# Altium schematic sheet ADC.SchDoc
size A4; SheetNumber: 5; SheetTotal: 14
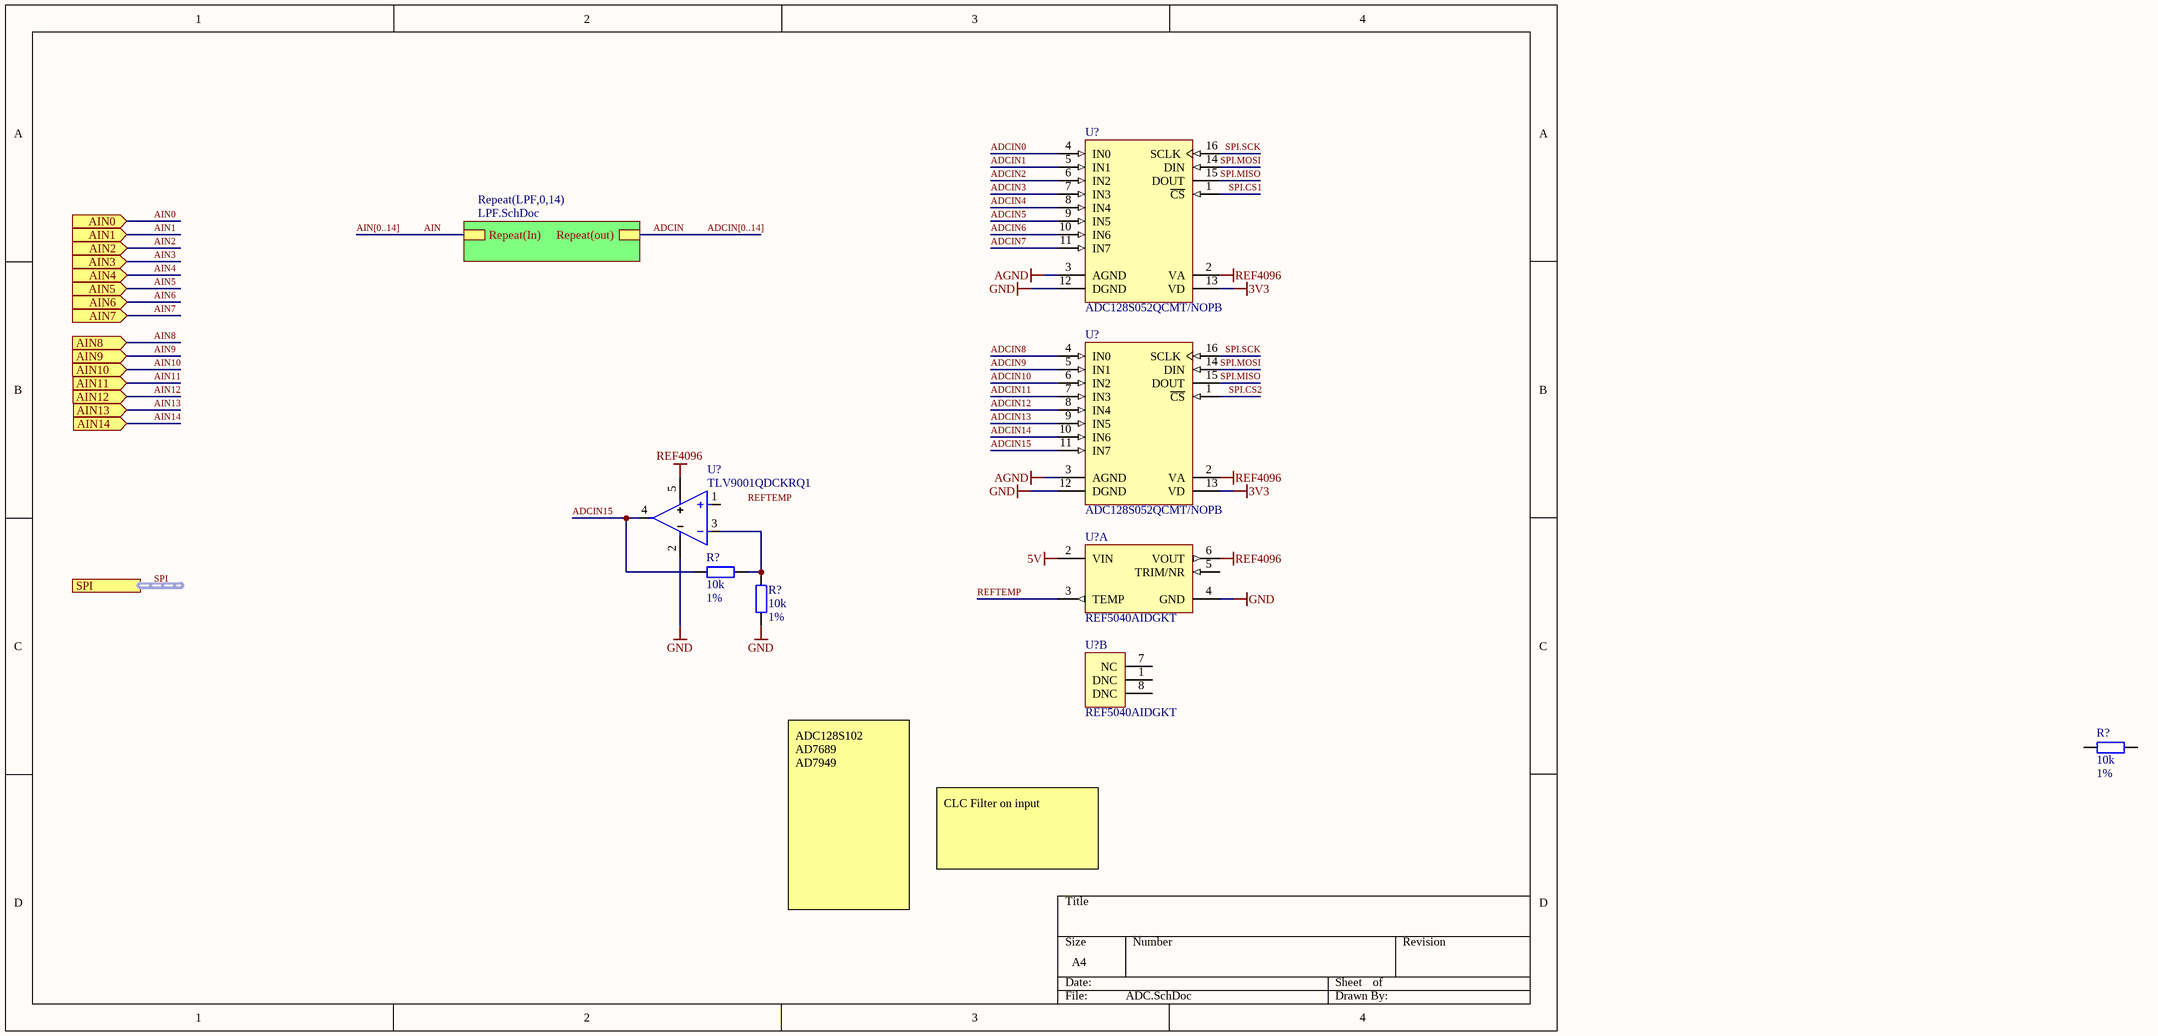
[diagram p0: ADC.SchDoc]

## Parts
(Parts that share a designator on the sheet are numbered #1, #2 ... from top to bottom, then left to right.)
R?#1  value 10k  Tolerance: 1%  [SMD_0603_RES]  (hidden comment: ERJ-3EKF1002V)
R?#2  value 10k  Tolerance: 1%  [SMD_0603_RES]  (hidden comment: ERJ-3EKF1002V)
R?#3  value 10k  Tolerance: 1%  [SMD_0603_RES]  (hidden comment: ERJ-3EKF1002V)
U?#1  ADC128S052QCMT/NOPB  [TI-PW16_L]
U?#2  ADC128S052QCMT/NOPB  [TI-PW16_L]
U?#3  TLV9001QDCKRQ1  [FP-DCK0005A-MFG]
U?#4  REF5040AIDGKT  [DGK0008A_N]  (part A of 2)
U?#5  REF5040AIDGKT  [DGK0008A_N]  (part B of 2)

## Sub-sheets
Repeat(LPF,0,14) = LPF.SchDoc: Repeat(In), Repeat(out)

## Ports
AIN0 (in), AIN1 (in), AIN2 (in), AIN3 (in), AIN4 (in), AIN5 (in), AIN6 (in), AIN7 (in), AIN8 (in), AIN9 (in), AIN10 (in), AIN11 (in), AIN12 (in), AIN13 (in), AIN14 (in), SPI (harness SPI)

## Nets
3V3: U?#1.13(VD) U?#2.13(VD)
5V: U?#4.2(VIN)
AGND: U?#1.3(AGND) U?#2.3(AGND)
GND: R?#2.1 U?#1.12(DGND) U?#2.12(DGND) U?#3.2(V-) U?#4.4(GND)
REF4096: U?#1.2(VA) U?#2.2(VA) U?#3.5(V+) U?#4.6(VOUT)
ADCIN: sheet Repeat(LPF,0,14)/Repeat(out)
ADCIN0: U?#1.4(IN0)
ADCIN1: U?#1.5(IN1)
ADCIN2: U?#1.6(IN2)
ADCIN3: U?#1.7(IN3)
ADCIN4: U?#1.8(IN4)
ADCIN5: U?#1.9(IN5)
ADCIN6: U?#1.10(IN6)
ADCIN7: U?#1.11(IN7)
ADCIN8: U?#2.4(IN0)
ADCIN9: U?#2.5(IN1)
ADCIN10: U?#2.6(IN2)
ADCIN11: U?#2.7(IN3)
ADCIN12: U?#2.8(IN4)
ADCIN13: U?#2.9(IN5)
ADCIN14: U?#2.10(IN6)
ADCIN15: R?#1.1 U?#2.11(IN7) U?#3.4(OUT)
AIN: sheet Repeat(LPF,0,14)/Repeat(In)
AIN0: port AIN0
AIN1: port AIN1
AIN2: port AIN2
AIN3: port AIN3
AIN4: port AIN4
AIN5: port AIN5
AIN6: port AIN6
AIN7: port AIN7
AIN8: port AIN8
AIN9: port AIN9
AIN10: port AIN10
AIN11: port AIN11
AIN12: port AIN12
AIN13: port AIN13
AIN14: port AIN14
REFTEMP: U?#4.3(TEMP)
SPI.CS1: U?#1.1(~{CS})
SPI.CS2: U?#2.1(~{CS})
SPI.MISO: U?#1.15(DOUT) U?#2.15(DOUT)
SPI.MOSI: U?#1.14(DIN) U?#2.14(DIN)
SPI.SCK: U?#1.16(SCLK) U?#2.16(SCLK)
NetR?#1_2: R?#1.2 R?#2.2 U?#3.3(-IN)

Not connected (* = marked no-connect by the designer): R?#3 1 2; U?#3 1(+IN); U?#4 5(TRIM/NR); U?#5 1(DNC) 7(NC) 8(DNC)

## Buses and harness runs
bus ADCIN[0..14]
bus AIN[0..14]
harness SPI = port SPI

## Notes on the sheet
- ADC128S102
  AD7689
  AD7949
- CLC Filter on input
- Labels drawn without touching a wire or pin: REFTEMP

## Library data of the parts
R?#1-R?#3 = CMP-009-07799-A10: RES SMD 10K OHM 1% 1/10W 0603 ±100ppm/°C; Voltage Rating: 75V; Power: 100mW; Pins: 2; RoHS Compliant: Yes; Temperature Coefficient: ±100ppm/°C; Operating Temperature (Min): -55°C; Mounting Technology: SMT; Case/Package: 0603; Operating Temperature (Max): 125°C
U?#1 U?#2 = CMP-0054-00500-3: 8-Channel, 200 to 500 kSPS, 12-Bit ADC, -40 to 125 degC, 16-pin SOP (PW16), Green (RoHS & no Sb/Br); Manufacturer: Texas Instruments; Resolution(Bits): 12; Digital Supply(Max)(V): 5.25; SNR(dB): 73; INL(Max)(+/-LSB): 1; Analog Voltage AV/DD(Min)(V): 2.7; SFDR(dB): 92; Interface: Serial SPI, QSPI, Microwire (Serial I/O); # Input Channels: 8; ENOB(Bits): 11.8; SubFamily: Precision ADC (<=10MSPS); Architecture: SAR; Sample Rate(max)(SPS): 500k; PartNumber: ADC128S052QCMT/NOPB; PackageDescription: 16-Pin Plastic Small Outline, Body 5 x 4.4 mm, Pitch 0.65 mm; Analog Voltage AV/DD(Max)(V): 5.25; PackageReference: PW16; Digital Supply(Min)(V): 2.7; Code_JEDEC: MO-153; PackageVersion: 4040064-4/G, 02/2011; ComponentLink2URL: http://www.ti.com/lit/ds/symlink/adc128s052-q1.pdf; ComponentLink3URL: http://www.ti.com/lit/ml/mpds361/mpds361.pdf; Mounting Technology: Surface Mount; ComponentLink1URL: http://www.ti.com/; SINAD(dB): 73; ComponentLink2Description: Datasheet; ComponentLink3Description: Package Specification; Eco-Plan: Green (RoHS & no Sb/Br); ComponentLink1Description: Manufacturer URL; DatasheetVersion: SNAS333D
U?#3 = CMP-014-00003-6: Operational Amplifier, 1 Func, 1500uV Offset-Max, CMOS, PDSO5; Nominal Supply Voltage: 5V; Channels: 1; Min Supply Voltage: 1.8V; Max Supply Voltage: 5.5V; Frequency: 1MHz; Mounting Technology: SMT; Output Type: CMOS; Min Operating Temperature: -40°C; Case/Package: SOT-SC70; RoHS Compliant: Yes; Pins: 5; Max Operating Temperature: 125°C
U?#4 U?#5 = CMP-0367-00268-2: Low Noise, Very Low Drift, Precision Voltage Reference, -40 to 125 degC, 8-pin MSOP (DGK), Green (RoHS & no Sb/Br); Manufacturer: Texas Instruments; VI(Min)(V): 4.296; Iout/Iz(Max)(mA): 10; Initial Accuracy @ 25/deg C(%): 0.05; SubFamily: Series Voltage Reference; VO(V): 4.096; Rating: Catalog; Temp Coeff(Max)(ppm/ degree C): 3; Iq(Max)(uA): 1000; VI(Max)(V): 18; DatasheetVersion: SBOS410E; ComponentLink3URL: http://www.ti.com/litv/pdf/mpds028d; ComponentLink1Description: Manufacturer URL; Eco-Plan: Green (RoHS & no Sb/Br); PackageReference: DGK0008A; PartNumber: REF5040AIDGKT; ComponentLink2URL: http://www.ti.com/general/docs/lit/getliterature.tsp?genericPartNumber=REF5040&fileType=pdf; Mounting Technology: Surface Mount; Code_JEDEC: MO-187; ComponentLink3Description: Package Specification; PackageVersion: 4073329/E; ComponentLink1URL: http://www.ti.com/; PackageDescription: 8-Pin Thin Small Outline Package 3 x 3 mm Body ,0.65 mm Pitch; ComponentLink2Description: Datasheet